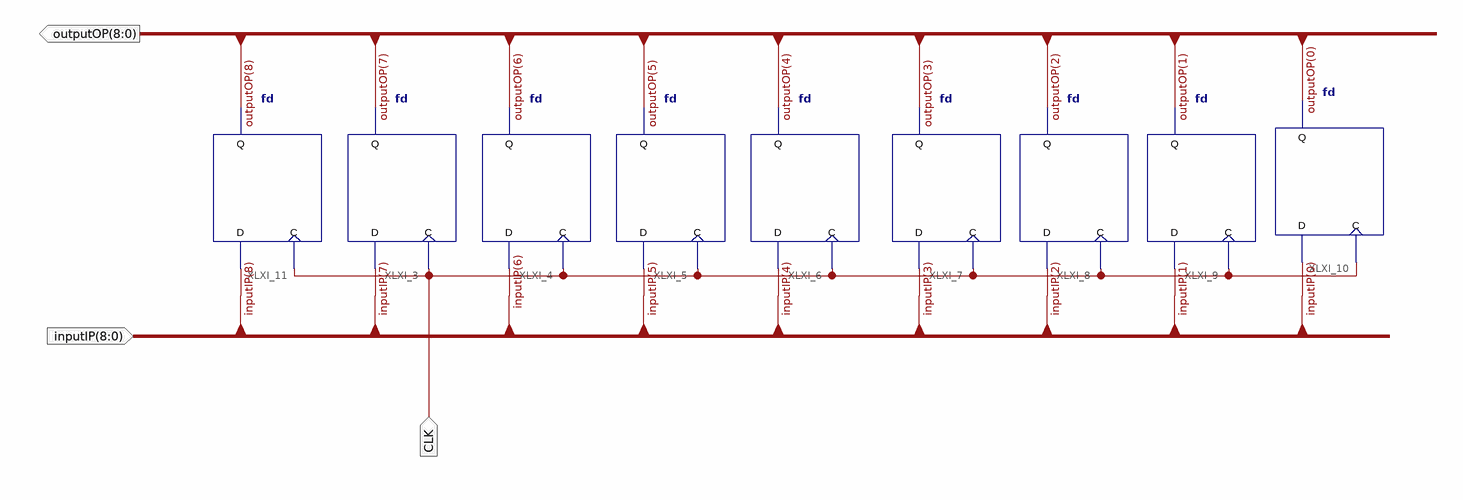
[diagram p0: schematic sheet 1]
// Xilinx ISE schematic Delay_sub.sch (spartan6) as structural Verilog: 9 symbols, 3 ports
module Delay_sub (
  input  [8:0] inputIP,
  input  CLK,
  output [8:0] outputOP
);

  fd XLXI_3 (.C(CLK), .D(inputIP[7]), .Q(outputOP[7]));
  fd XLXI_4 (.C(CLK), .D(inputIP[6]), .Q(outputOP[6]));
  fd XLXI_5 (.C(CLK), .D(inputIP[5]), .Q(outputOP[5]));
  fd XLXI_6 (.C(CLK), .D(inputIP[4]), .Q(outputOP[4]));
  fd XLXI_7 (.C(CLK), .D(inputIP[3]), .Q(outputOP[3]));
  fd XLXI_8 (.C(CLK), .D(inputIP[2]), .Q(outputOP[2]));
  fd XLXI_9 (.C(CLK), .D(inputIP[1]), .Q(outputOP[1]));
  fd XLXI_10 (.C(CLK), .D(inputIP[0]), .Q(outputOP[0]));
  fd XLXI_11 (.C(CLK), .D(inputIP[8]), .Q(outputOP[8]));
endmodule
